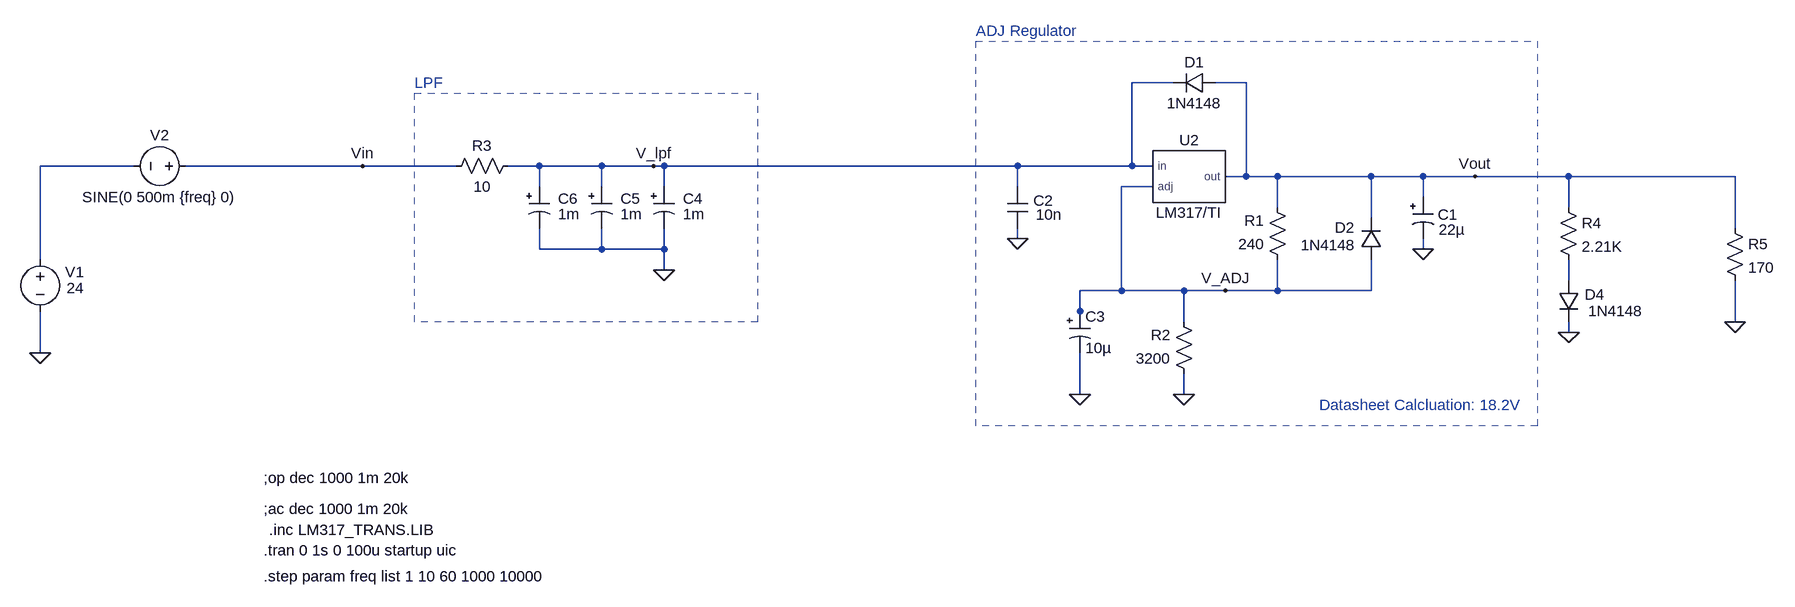
[diagram p0: schematic power-filter.asc]
power-filter.asc, the LTspice schematic file:
Version 4
SHEET 1 1320 808
WIRE 144 32 80 32
WIRE 256 32 208 32
WIRE -1456 160 -1600 160
WIRE -1104 160 -1376 160
WIRE -960 160 -1104 160
WIRE -832 160 -880 160
WIRE -736 160 -832 160
WIRE -656 160 -736 160
WIRE -640 160 -656 160
WIRE -96 160 -640 160
WIRE 80 160 80 32
WIRE 80 160 -96 160
WIRE 112 160 80 160
WIRE 256 176 256 32
WIRE 256 176 224 176
WIRE 304 176 256 176
WIRE 448 176 304 176
WIRE 528 176 448 176
WIRE 608 176 528 176
WIRE 752 176 608 176
WIRE 1008 176 752 176
WIRE -832 192 -832 160
WIRE -736 192 -736 160
WIRE -640 192 -640 160
WIRE -96 192 -96 160
WIRE 112 192 64 192
WIRE 528 208 528 176
WIRE 304 224 304 176
WIRE 752 224 752 176
WIRE 448 240 448 176
WIRE 1008 256 1008 176
WIRE -96 272 -96 256
WIRE -832 288 -832 256
WIRE -736 288 -736 256
WIRE -736 288 -832 288
WIRE -640 288 -640 256
WIRE -640 288 -736 288
WIRE 528 288 528 272
WIRE -1600 304 -1600 160
WIRE -640 320 -640 288
WIRE 752 336 752 304
WIRE 64 352 64 192
WIRE 64 352 0 352
WIRE 160 352 64 352
WIRE 224 352 160 352
WIRE 304 352 304 304
WIRE 304 352 224 352
WIRE 448 352 448 304
WIRE 448 352 304 352
WIRE 0 384 0 352
WIRE 0 400 0 384
WIRE 160 400 160 352
WIRE 1008 400 1008 336
WIRE 752 416 752 400
WIRE -1600 448 -1600 384
WIRE 0 512 0 448
WIRE 160 512 160 480
FLAG 160 512 0
FLAG 528 288 0
FLAG 0 512 0
FLAG -96 272 0
FLAG -1104 160 Vin
FLAG 608 176 Vout
FLAG -640 320 0
FLAG -656 160 V_lpf
FLAG -1600 448 0
FLAG 752 416 0
FLAG 224 352 V_ADJ
FLAG 1008 400 0
SYMBOL res 320 320 R180
WINDOW 0 36 76 Left 2
WINDOW 3 36 40 Left 2
SYMATTR InstName R1
SYMATTR Value 240
SYMATTR SpiceLine tol=1 pwr=0.21
SYMBOL res 176 496 R180
WINDOW 0 36 76 Left 2
WINDOW 3 36 40 Left 2
SYMATTR InstName R2
SYMATTR Value 3200
SYMATTR SpiceLine tol=1 pwr=0.21
SYMBOL polcap 512 208 R0
WINDOW 0 39 27 Left 2
WINDOW 3 40 50 Left 2
SYMATTR InstName C1
SYMATTR Value 22µ
SYMATTR Description Capacitor
SYMATTR Type cap
SYMATTR SpiceLine V=50 Irms=170m Rser=1 Lser=0 mfg="Nichicon" pn="UPG1H220MPH" type="Al electrolytic"
SYMBOL diode 208 16 R90
WINDOW 0 0 32 VBottom 2
WINDOW 3 32 32 VTop 2
SYMATTR InstName D1
SYMATTR Value 1N4148
SYMBOL diode 464 304 R180
WINDOW 0 41 49 Left 2
WINDOW 3 39 22 Left 2
SYMATTR InstName D2
SYMATTR Value 1N4148
SYMBOL cap -112 192 R0
WINDOW 0 40 21 Left 2
WINDOW 3 44 43 Left 2
SYMATTR InstName C2
SYMATTR Value 10n
SYMATTR SpiceLine V=50 Irms=0 Rser=0.0124 Lser=188p mfg="Würth Elektronik" pn="885012009023 WCAP-CSGP 1210" type="NP0"
SYMBOL polcap -16 384 R0
WINDOW 3 24 56 Left 2
SYMATTR InstName C3
SYMATTR Value 10µ
SYMATTR Description Capacitor
SYMATTR Type cap
SYMATTR SpiceLine V=50 Irms=50m Rser=2.2 Lser=0 mfg="Nichicon" pn="UPR1H100MAH" type="Al electrolytic"
SYMBOL polcap -656 192 R0
WINDOW 0 45 18 Left 2
WINDOW 3 45 42 Left 2
SYMATTR InstName C4
SYMATTR Value 1m
SYMATTR Description Capacitor
SYMATTR Type cap
SYMATTR SpiceLine V=50 Irms=1.68 Rser=0.04 Lser=0
SYMBOL polcap -752 192 R0
WINDOW 0 45 18 Left 2
WINDOW 3 45 42 Left 2
SYMATTR InstName C5
SYMATTR Value 1m
SYMATTR Description Capacitor
SYMATTR Type cap
SYMATTR SpiceLine V=50 Irms=1.68 Rser=0.04 Lser=0
SYMBOL polcap -848 192 R0
WINDOW 0 45 18 Left 2
WINDOW 3 45 42 Left 2
SYMATTR InstName C6
SYMATTR Value 1m
SYMATTR Description Capacitor
SYMATTR Type cap
SYMATTR SpiceLine V=50 Irms=1.68 Rser=0.04 Lser=0
SYMBOL res -864 144 R90
WINDOW 0 0 56 VBottom 2
WINDOW 3 32 56 VTop 2
SYMATTR InstName R3
SYMATTR Value 10
SYMATTR SpiceLine tol=1 pwr=3
SYMBOL voltage -1600 288 R0
WINDOW 0 38 35 Left 2
WINDOW 3 41 60 Left 2
WINDOW 123 0 0 Left 0
WINDOW 39 39 86 Left 2
SYMATTR InstName V1
SYMATTR Value 24
SYMBOL diode 736 336 R0
WINDOW 0 41 22 Left 2
WINDOW 3 46 47 Left 2
SYMATTR InstName D4
SYMATTR Value 1N4148
SYMBOL res 736 208 R0
SYMATTR InstName R4
SYMATTR Value 2.21K
SYMATTR SpiceLine tol=1 pwr=0.1
SYMBOL res 992 240 R0
SYMATTR InstName R5
SYMATTR Value 170
SYMBOL LM317_TI 160 176 R0
SYMATTR InstName U2
SYMBOL voltage -1360 160 R90
WINDOW 0 -32 56 VBottom 2
WINDOW 3 32 56 VTop 2
WINDOW 123 0 0 Left 0
WINDOW 39 0 0 Left 0
SYMATTR InstName V2
SYMATTR Value SINE(0 500m {freq} 0)
TEXT -160 -48 Left 2 ;ADJ Regulator
TEXT 368 528 Left 2 ;Datasheet Calcluation: 18.2V
TEXT -1024 32 Left 2 ;LPF
TEXT -1256 752 Left 2 !.tran 0 1s 0 100u startup uic
TEXT -1248 720 Left 2 !.inc LM317_TRANS.LIB
TEXT -1256 688 Left 2 !;ac dec 1000 1m 20k
TEXT -1256 640 Left 2 !;op dec 1000 1m 20k
TEXT -1256 792 Left 2 !.step param freq list 1 10 60 1000 10000
RECTANGLE Normal 704 560 -160 -32 2
RECTANGLE Normal -496 400 -1024 48 2

The netlist it stands for:
* power-filter.asc
R1 V_ADJ Vout 240 tol=1 pwr=0.21
R2 0 V_ADJ 3200 tol=1 pwr=0.21
C1 Vout 0 22µ V=50 Irms=170m Rser=1 Lser=0 mfg="Nichicon" pn="UPG1H220MPH" type="Al electrolytic"
D1 Vout V_lpf 1N4148
D2 V_ADJ Vout 1N4148
C2 V_lpf 0 10n V=50 Irms=0 Rser=0.0124 Lser=188p mfg="Würth Elektronik" pn="885012009023 WCAP-CSGP 1210" type="NP0"
C3 V_ADJ 0 10µ V=50 Irms=50m Rser=2.2 Lser=0 mfg="Nichicon" pn="UPR1H100MAH" type="Al electrolytic"
C4 V_lpf 0 1m V=50 Irms=1.68 Rser=0.04 Lser=0
C5 V_lpf 0 1m V=50 Irms=1.68 Rser=0.04 Lser=0
C6 V_lpf 0 1m V=50 Irms=1.68 Rser=0.04 Lser=0
R3 V_lpf Vin 10 tol=1 pwr=3
V1 N001 0 24
D4 N002 0 1N4148
R4 Vout N002 2.21K tol=1 pwr=0.1
R5 Vout 0 170
XU2 V_lpf V_ADJ Vout LM317/TI  ; pins in adj out
V2 Vin N001 SINE(0 500m {freq} 0)
.model D D
.lib standard.dio
* ADJ Regulator
* Datasheet Calcluation: 18.2V
* LPF
.tran 0 1s 0 100u startup uic
.inc LM317_TRANS.LIB
;ac dec 1000 1m 20k
;op dec 1000 1m 20k
.step param freq list 1 10 60 1000 10000
.lib D:\Users\seth\Documents\Git\ez-test-stand\hardware\ltspice\lm317_transistor.lib
.backanno
.end